# EAGLE board OOBD-TigerV2_old (EAGLE 7.2.0)
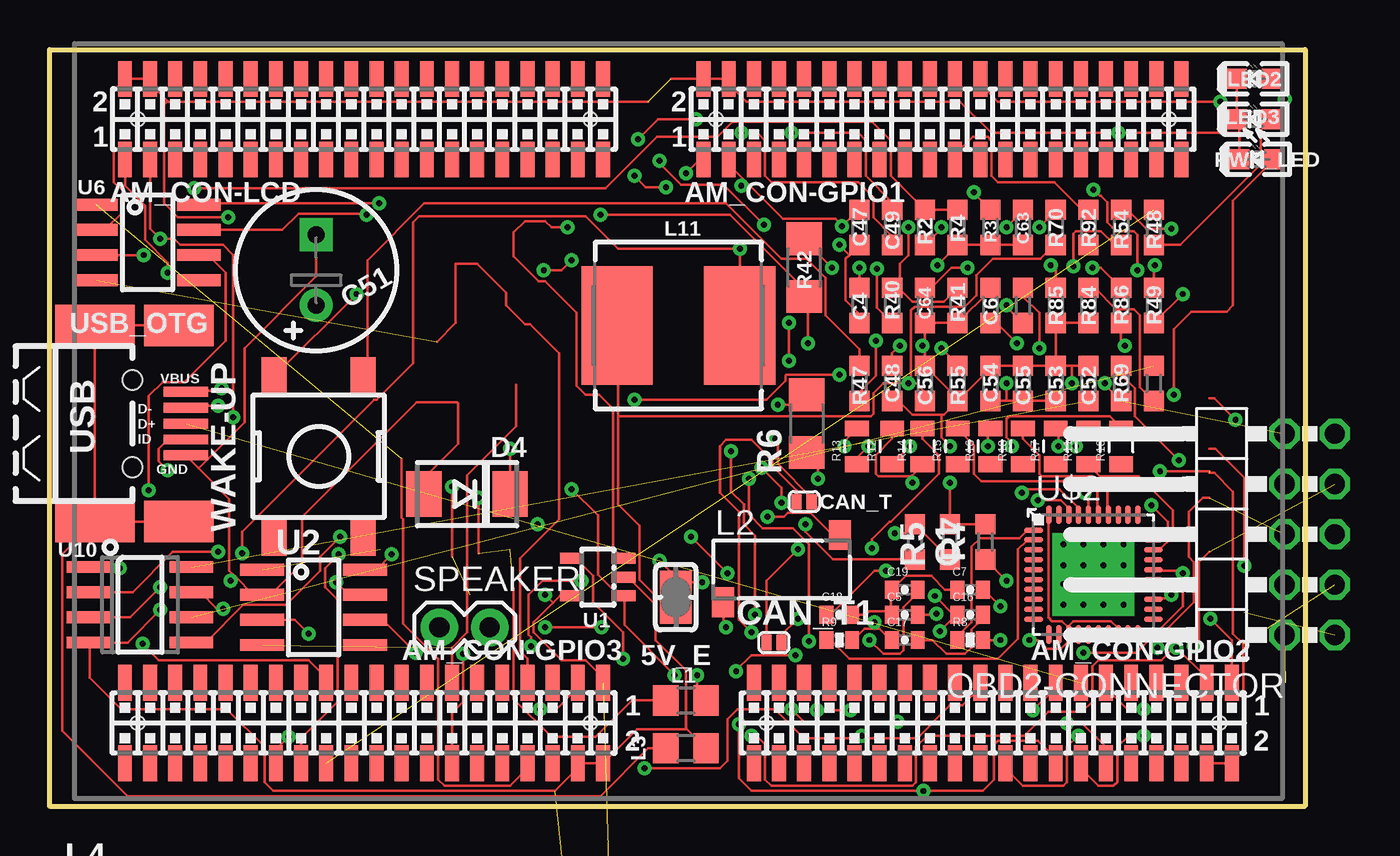
[diagram p5: board, top side]
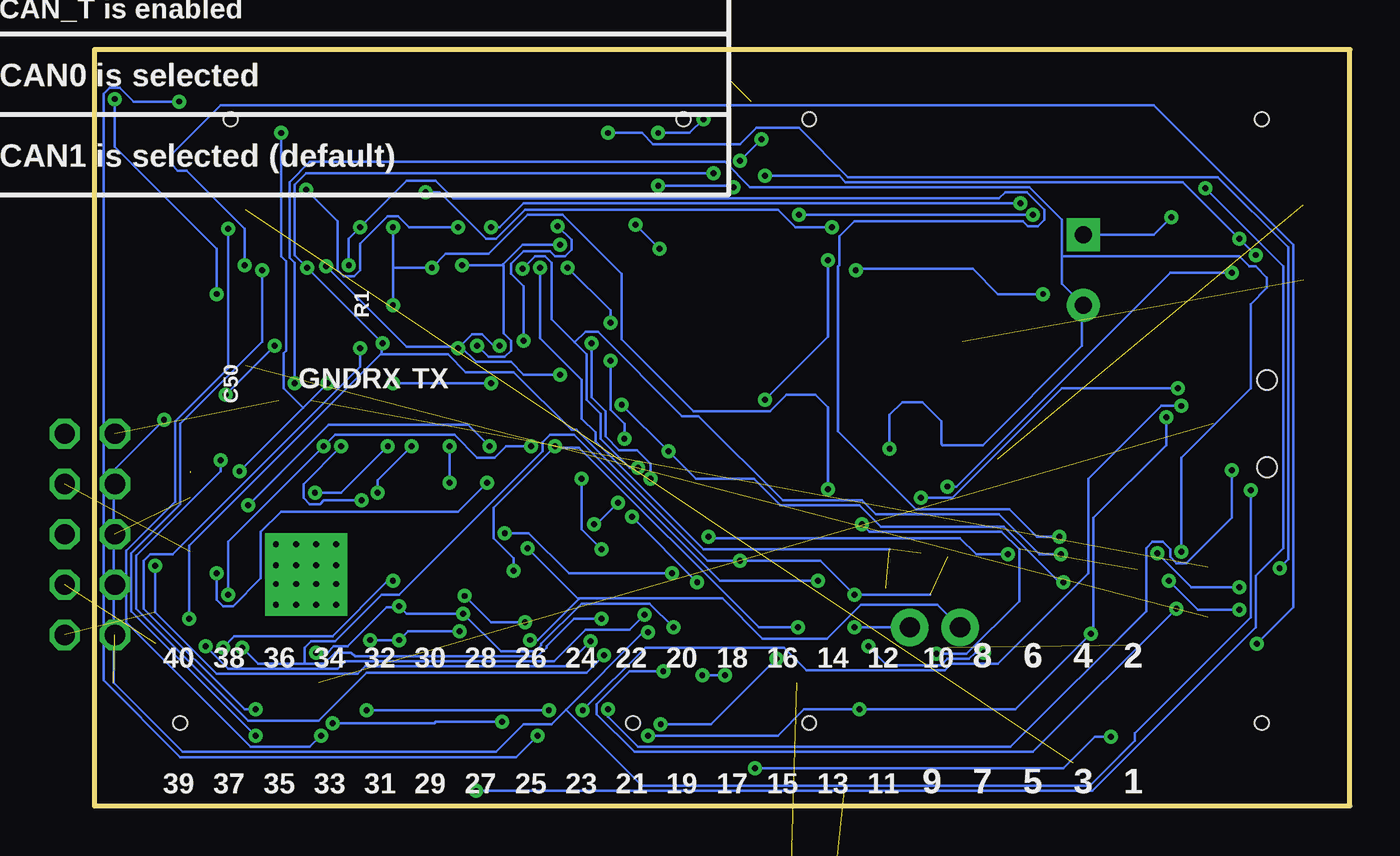
[diagram p6: board, bottom side, seen from below]

Size 63.39 x 38.18 mm. Coordinates in mm from the lower left corner, seen from the top.
Outline: 0,0 63.39,0 63.39,38.18 0,38.18 0,0
Copper layers (1+16): Top 0.035mm / dielectric 1.5mm / Bottom 0.035mm
Design rules "default": minimum track width 5mil, minimum drill 0.3mm, track to track 5mil, track to pad 5mil, pad to pad 5mil, via to via 5mil, smd to smd 1mil, copper to edge 10mil, drill to drill 8mil, minimum pad ring 8mil, minimum via ring 8mil, stop-mask expansion 4mil, vias tented up to drill 25mil, thermal gap 20mil
Net classes: 2 lan_sh: clearance 0.762 mm

## Footprints (pad centres in the part's own frame; a part is rotated, then mirrored left to right if it is on the bottom)
SJ-CLOSE = smd 1.168 x 1.6: 1 -0.762,0; 2 0.762,0
AM3352-SOM-EVB = smd 0.7 x 1.8: 1-1 -27.94,13.208; 1-2 -27.94,17.272; 1-3 -26.67,13.208; 1-4 -26.67,17.272; 1-5 -25.4,13.208; 1-6 -25.4,17.272; 1-7 -24.13,13.208; 1-8 -24.13,17.272; 1-9 -22.86,13.208; 1-10 -22.86,17.272; 1-11 -21.59,13.208; 1-12 -21.59,17.272; 1-13 -20.32,13.208; 1-14 -20.32,17.272; 1-15 -19.05,13.208; 1-16 -19.05,17.272; 1-17 -17.78,13.208; 1-18 -17.78,17.272; 1-19 -16.51,13.208; 1-20 -16.51,17.272; 1-21 -15.24,13.208; 1-22 -15.24,17.272; 1-23 -13.97,13.208; 1-24 -13.97,17.272; 1-25 -12.7,13.208; 1-26 -12.7,17.272; 1-27 -11.43,13.208; 1-28 -11.43,17.272; 1-29 -10.16,13.208; 1-30 -10.16,17.272; 1-31 -8.89,13.208; 1-32 -8.89,17.272; 1-33 -7.62,13.208; 1-34 -7.62,17.272; 1-35 -6.35,13.208; 1-36 -6.35,17.272; 1-37 -5.08,13.208; 1-38 -5.08,17.272; 1-39 -3.81,13.208; 1-40 -3.81,17.272; 2-1 1.27,13.208; 2-2 1.27,17.272; 2-3 2.54,13.208; 2-4 2.54,17.272; 2-5 3.81,13.208; 2-6 3.81,17.272; 2-7 5.08,13.208; 2-8 5.08,17.272; 2-9 6.35,13.208; 2-10 6.35,17.272; 2-11 7.62,13.208; 2-12 7.62,17.272; 2-13 8.89,13.208; 2-14 8.89,17.272; 2-15 10.16,13.208; 2-16 10.16,17.272; 2-17 11.43,13.208; 2-18 11.43,17.272; 2-19 12.7,13.208; 2-20 12.7,17.272; 2-21 13.97,13.208; 2-22 13.97,17.272; 2-23 15.24,13.208; 2-24 15.24,17.272; 2-25 16.51,13.208; 2-26 16.51,17.272; 2-27 17.78,13.208; 2-28 17.78,17.272; 2-29 19.05,13.208; 2-30 19.05,17.272; 2-31 20.32,13.208; 2-32 20.32,17.272; 2-33 21.59,13.208; 2-34 21.59,17.272; 2-35 22.86,13.208; 2-36 22.86,17.272; 2-37 24.13,13.208; 2-38 24.13,17.272; 2-39 25.4,13.208; 2-40 25.4,17.272; 3-1 27.94,-13.208; 3-2 27.94,-17.272; 3-3 26.67,-13.208; 3-4 26.67,-17.272; 3-5 25.4,-13.208; 3-6 25.4,-17.272; 3-7 24.13,-13.208; 3-8 24.13,-17.272; 3-9 22.86,-13.208; 3-10 22.86,-17.272; 3-11 21.59,-13.208; 3-12 21.59,-17.272; 3-13 20.32,-13.208; 3-14 20.32,-17.272; 3-15 19.05,-13.208; 3-16 19.05,-17.272; 3-17 17.78,-13.208; 3-18 17.78,-17.272; 3-19 16.51,-13.208; 3-20 16.51,-17.272; 3-21 15.24,-13.208; 3-22 15.24,-17.272; 3-23 13.97,-13.208; 3-24 13.97,-17.272; 3-25 12.7,-13.208; 3-26 12.7,-17.272; 3-27 11.43,-13.208; 3-28 11.43,-17.272; 3-29 10.16,-13.208; 3-30 10.16,-17.272; 3-31 8.89,-13.208; 3-32 8.89,-17.272; 3-33 7.62,-13.208; 3-34 7.62,-17.272; 3-35 6.35,-13.208; 3-36 6.35,-17.272; 3-37 5.08,-13.208; 3-38 5.08,-17.272; 3-39 3.81,-13.208; 3-40 3.81,-17.272; 4-1 -3.81,-13.208; 4-2 -3.81,-17.272; 4-3 -5.08,-13.208; 4-4 -5.08,-17.272; 4-5 -6.35,-13.208; 4-6 -6.35,-17.272; 4-7 -7.62,-13.208; 4-8 -7.62,-17.272; 4-9 -8.89,-13.208; 4-10 -8.89,-17.272; 4-11 -10.16,-13.208; 4-12 -10.16,-17.272; 4-13 -11.43,-13.208; 4-14 -11.43,-17.272; 4-15 -12.7,-13.208; 4-16 -12.7,-17.272; 4-17 -13.97,-13.208; 4-18 -13.97,-17.272; 4-19 -15.24,-13.208; 4-20 -15.24,-17.272; 4-21 -16.51,-13.208; 4-22 -16.51,-17.272; 4-23 -17.78,-13.208; 4-24 -17.78,-17.272; 4-25 -19.05,-13.208; 4-26 -19.05,-17.272; 4-27 -20.32,-13.208; 4-28 -20.32,-17.272; 4-29 -21.59,-13.208; 4-30 -21.59,-17.272; 4-31 -22.86,-13.208; 4-32 -22.86,-17.272; 4-33 -24.13,-13.208; 4-34 -24.13,-17.272; 4-35 -25.4,-13.208; 4-36 -25.4,-17.272; 4-37 -26.67,-13.208; 4-38 -26.67,-17.272; 4-39 -27.94,-13.208; 4-40 -27.94,-17.272 | hole 0.7: -27.305,15.24; -4.445,15.24; 1.905,15.24; 24.765,15.24; 27.305,-15.24; 4.445,-15.24; -4.445,-15.24; -27.305,-15.24
C0603_DWS = smd 1.016 x 1.016: 1 -0.889,0; 2 0.889,0
0402-CAP = smd 0.7 x 0.9: 1 -0.65,0; 2 0.65,0
E3,5-8 = drill 0.864 pad 1.676: + -1.778,0 | drill 0.864 pad 1.676 square: - 1.778,0
SJ_1_SMALLER = smd 0.508 x 0.762: 1 -0.381,0; 2 0.381,0
DO214AA = smd 1.778 x 2.286: A 2.177,0; C -2.177,0
L0805_5MIL_DWS = smd 1.27 x 1.524: 1 -1.016,0; 2 1.016,0
SM-L15B = smd 1.1 x 1.5: 1 -2.95,-1.65; 2 2.95,1.75
8X8MM_3131 = smd 3.6 x 6: 1 -3.1,0; 2 3.1,0
LED_0603 = smd 1.016 x 1.016: A 0.889,0; C -0.889,0
2X05/90 = drill 1.016 octagon: 1 -5.08,-6.35; 2 -5.08,-3.81; 3 -2.54,-6.35; 4 -2.54,-3.81; 5 0,-6.35; 6 0,-3.81; 7 2.54,-6.35; 8 2.54,-3.81; 9 5.08,-6.35; 10 5.08,-3.81
LED-0603 = smd 1.016 x 1.016: A 0.889,0; C -0.889,0
R0603_5MIL_DWS = smd 1.016 x 1.016: 1 -0.889,0; 2 0.889,0
R1206_5MIL_WS = smd 1.651 x 1.778: 1 -1.46,0; 2 1.46,0
0402-RES = smd 0.7 x 0.9: 1 -0.65,0; 2 0.65,0
0805 = smd 0.8 x 1.2: 1 -0.9,0; 2 0.9,0
1X02 = drill 1.016 pad 1.88: 1 0,0; 2 2.54,0
SOT23-5 = smd 1.2 x 0.55: 1 1.3,-0.95; 2 1.3,0; 3 1.3,0.95; 4 -1.3,0.95; 5 -1.3,-0.95
SO-08 = smd 0.6 x 2.2: 1 -1.905,-2.6; 2 -0.635,-2.6; 3 0.635,-2.6; 4 1.905,-2.6; 5 1.905,2.6; 6 0.635,2.6; 7 -0.635,2.6; 8 -1.905,2.6
SOIC8 = smd 0.6 x 2.2: 1 -1.905,-2.6; 2 -0.635,-2.6; 3 0.635,-2.6; 4 1.905,-2.6; 5 1.905,2.6; 6 0.635,2.6; 7 -0.635,2.6; 8 -1.905,2.6
QFN40-6X6 = smd 0.95 x 0.28: 1 -3.025,2.25; 2 -3.025,1.75; 3 -3.025,1.25; 4 -3.025,0.75; 5 -3.025,0.25; 6 -3.025,-0.25; 7 -3.025,-0.75; 8 -3.025,-1.25; 9 -3.025,-1.75; 10 -3.025,-2.25; 21 3.025,-2.25; 22 3.025,-1.75; 23 3.025,-1.25; 24 3.025,-0.75; 25 3.025,-0.25; 26 3.025,0.25; 27 3.025,0.75; 28 3.025,1.25; 29 3.025,1.75; 30 3.025,2.25 | smd 0.28 x 0.95: 11 -2.25,-3.025; 12 -1.75,-3.025; 13 -1.25,-3.025; 14 -0.75,-3.025; 15 -0.25,-3.025; 16 0.25,-3.025; 17 0.75,-3.025; 18 1.25,-3.025; 19 1.75,-3.025; 20 2.25,-3.025; 31 2.25,3.025; 32 1.75,3.025; 33 1.25,3.025; 34 0.75,3.025; 35 0.25,3.025; 36 -0.25,3.025; 37 -0.75,3.025; 38 -1.25,3.025; 39 -1.75,3.025; 40 -2.25,3.025 | drill 0.3 pad 1.1 square: EP@1 -1.525,1.525; EP@2 -0.5,1.525; EP@3 0.5,1.525; EP@4 1.525,1.525; EP@5 -1.525,0.475; EP@6 -0.5,0.475; EP@7 0.5,0.475; EP@8 1.525,0.475; EP@9 -1.525,-0.475; EP@10 -0.5,-0.475; EP@11 0.5,-0.475; EP@12 1.525,-0.475; EP@13 -1.525,-1.525; EP@14 -0.5,-1.525; EP@15 0.5,-1.525; EP@16 1.525,-1.525
USB_MINI_9PIN = smd 2.25 x 0.5: D+ 2.706,0; D- 2.706,0.8; GND 2.706,-1.6; ID 2.706,-0.8; VBUS 2.706,1.6 | smd 4 x 2.1: GND1 -1.9,4.95; GND3 -1.9,-4.95 | smd 3.5 x 2.1: GND2 2.35,4.95; GND4 2.35,-4.95 | hole 1: 0,2.2; 0,-2.2
T1157 = smd 1.27 x 1.905: 1 -2.25,4.054; 2 2.25,4.054; 3 2.25,-4.054; 4 -2.25,-4.054

## Placement (x,y rotation side)
5V_E  Close  [SJ-CLOSE]  31.62,10.54 90 top
5V_E1  Close  [SJ-CLOSE]  2.54,-55.88 0 top  (outside the outline)
AM3352-SOM-EVB-PLATFORM  4XGPH127SMT-02X20(PA-V16X-2X20-LF)  [AM3352-SOM-EVB]  31.75,19.43 0 top
C1  100nF  [C0603_DWS]  47.24,13.34 90 top
C2  100nF  [C0603_DWS]  10.16,-55.88 0 top  (outside the outline)
C3  10nF  [C0603_DWS]  25.4,-55.88 0 top  (outside the outline)
C4  100nF  [C0603_DWS]  40.89,25.27 270 top
C5  47pF  [0402-CAP]  43.18,9.65 0 top
C6  100nF  [C0603_DWS]  47.5,25.27 90 top
C7  47pF  [0402-CAP]  46.48,10.92 0 top
C8  3.3nF  [C0603_DWS]  17.78,-55.88 0 top  (outside the outline)
C9  22uF/6.3V  [C0603_DWS]  27.94,-30.48 0 top  (outside the outline)
C10  470uF/25V/LOWESR/105C  [E3,5-8]  2.54,-22.86 0 top  (outside the outline)
C11  22uF/6.3V  [C0603_DWS]  0,-40.64 0 top  (outside the outline)
C12  22uF/6.3V  [C0603_DWS]  12.7,-40.64 0 top  (outside the outline)
C13  22uF/6.3V  [C0603_DWS]  25.4,-40.64 0 top  (outside the outline)
C16  22µf  [0402-CAP]  46.48,9.65 0 top
C17  0.1µf  [0402-CAP]  43.18,8.38 0 top
C18  0,01µF  [0402-CAP]  39.88,9.65 0 top
C19  0,01µF  [0402-CAP]  43.18,10.92 0 top
C47  100nF  [C0603_DWS]  40.89,29.21 270 top
C48  100nF  [C0603_DWS]  42.55,21.34 270 top
C49  10nF  [C0603_DWS]  42.55,29.21 270 top
C50  3.3nF  [C0603_DWS]  55.75,21.34 270 top
C51  470uF/25V/LOWESR/105C  [E3,5-8]  13.46,27.05 90 top
C52  100nF  [C0603_DWS]  52.45,21.34 90 top
C53  22uF/6.3V  [C0603_DWS]  50.8,21.34 90 top
C54  22uF/6.3V  [C0603_DWS]  47.5,21.34 90 top
C55  22uF/6.3V  [C0603_DWS]  49.15,21.34 90 top
C56  22uF/6.3V  [C0603_DWS]  44.2,21.34 90 top
C63  22uF/6.3V  [C0603_DWS]  49.15,29.21 270 top
C64  22uF/6.3V  [C0603_DWS]  44.2,25.27 270 top
CAN_T  Open  [SJ_1_SMALLER]  38.1,15.37 180 top
CAN_T1  Open  [SJ_1_SMALLER]  36.58,8.26 0 top
D4  SMBJ16A  [DO214AA]  21.08,15.75 180 top
L1  FB0805/600R/2A  [L0805_5MIL_DWS]  32.13,5.33 0 top
L2  [SM-L15B]  36.96,11.94 0 top
L3  FB0805/600R/200mA(201209-601)  [L0805_5MIL_DWS]  32.13,2.92 180 top
L4  10uH/3.15A/20%  [8X8MM_3131]  5.08,-7.62 0 top  (outside the outline)
L11  10uH/3.15A/20%  [8X8MM_3131]  31.75,24.26 180 top
LED2  LED/Red/0603  [LED_0603]  60.83,36.7 0 top
LED3  LED/Yellow/0603  [LED_0603]  60.83,34.67 0 top
OBD2-CONNECTOR  [2X05/90]  58.55,13.72 90 top
PWR_LED  LED/Red/0603  [LED-0603]  60.96,32.64 0 top
PWR_LED1  LED/Red/0603  [LED-0603]  12.7,-33.02 0 top  (outside the outline)
R1  2.2k/1%  [R0603_5MIL_DWS]  49.15,25.27 270 top
R2  NA  [R0603_5MIL_DWS]  44.2,29.21 270 top
R3  13k/1%  [R0603_5MIL_DWS]  47.5,29.21 90 top
R4  10k  [R0603_5MIL_DWS]  45.85,29.21 90 top
R5  10k  [R0603_5MIL_DWS]  45.47,13.34 90 top
R6  120R  [R1206_5MIL_WS]  38.23,19.3 90 top
R7  NA  [R0603_5MIL_DWS]  43.69,13.34 270 top
R8  10K  [0402-RES]  46.48,8.38 0 top
R9  10K  [0402-RES]  39.88,8.38 0 top
R10  0  [0805]  54.1,18.16 90 top
R11  0  [0805]  52.45,18.16 90 top
R12  0  [0805]  42.55,18.16 90 top
R13  0  [0805]  40.77,18.16 90 top
R14  0  [0805]  44.07,18.16 90 top
R15  0  [0805]  45.85,18.16 90 top
R16  0  [0805]  47.5,18.16 90 top
R17  0  [0805]  50.8,18.16 90 top
R18  0  [0805]  49.15,18.16 90 top
R19  10k  [R0603_5MIL_DWS]  33.02,-55.88 0 top  (outside the outline)
R20  2.2k/1%  [R0603_5MIL_DWS]  20.32,-48.26 0 top  (outside the outline)
R21  1.05k/1%  [R0603_5MIL_DWS]  0,-48.26 0 top  (outside the outline)
R22  4.99k/1%  [R0603_5MIL_DWS]  10.16,-48.26 0 top  (outside the outline)
R23  2.2k/1%  [R0603_5MIL_DWS]  30.48,-48.26 0 top  (outside the outline)
R40  NA  [R0603_5MIL_DWS]  42.55,25.27 270 top
R41  10k  [R0603_5MIL_DWS]  45.85,25.27 270 top
R42  120R  [R1206_5MIL_WS]  38.1,27.18 270 top
R47  2.2k/1%  [R0603_5MIL_DWS]  40.89,21.34 270 top
R48  2.2k/1%  [R0603_5MIL_DWS]  55.75,29.21 270 top
R49  2.2k/1%  [R0603_5MIL_DWS]  55.75,25.27 270 top
R54  49.9R/1%  [R0603_5MIL_DWS]  54.1,29.21 270 top
R55  NA  [R0603_5MIL_DWS]  45.85,21.34 270 top
R69  10k  [R0603_5MIL_DWS]  54.1,21.34 90 top
R70  4.99k/1%  [R0603_5MIL_DWS]  50.8,29.21 270 top
R84  2.2k/1%  [R0603_5MIL_DWS]  52.45,25.27 270 top
R85  1.05k/1%  [R0603_5MIL_DWS]  50.8,25.27 270 top
R86  2.2k/1%  [R0603_5MIL_DWS]  54.1,25.27 270 top
R92  0R  [R0603_5MIL_DWS]  52.45,29.21 90 top
SPEAKER  LS1  [1X02]  19.68,9.02 0 top
U1  SY6280  [SOT23-5]  27.69,11.56 0 top
U2  SN65HVD230(SO8)  [SO-08]  13.34,10.03 270 top
U3  MP1482DS  [SOIC8]  30.48,-22.86 0 top  (outside the outline)
U6  SN65HVD230(SO8)  [SO-08]  4.95,28.45 270 top
U10  MP1482DS  [SOIC8]  4.57,10.16 270 top
U$2  [QFN40-6X6]  52.7,11.68 0 top
USB_OTG  USB-OTG  [USB_MINI_9PIN]  4.19,19.3 0 top
WAKE-UP  T1157  [T1157]  13.59,17.65 0 top

## Tracks (layer width: path | path; a pad name or v marks a point on that pad's centre or on a via)
3.3V  (via drill 0.3)
  Top 0.127: 41.66,8.95 41.91,8.95 42.48,8.38 C17.1 | 41.66,8.95 41.15,8.95 40.58,8.38 R9.2 | v48.01,8.38 R8.2 | v49.47,8.38 49.91,8.38 50.35,7.94 51.05,7.94 51.44,8.32 51.44,8.64 U$2.13 | v44.96,8.83 45.72,9.59 | 45.72,9.59 45.78,9.65 C16.1 45.72,9.59 | U$2.40 50.42,14.67 50.42,9.53 50.61,9.34 51.12,9.34 51.44,9.02 51.44,8.7 U$2.13 | U$2.18 53.91,8.7 53.91,9.02 53.59,9.34 51.69,9.34 51.44,9.08 U$2.13 | v41.66,9.27 41.66,8.95 | 45.72,9.59 v44.7,10.6
  Bottom 0.127: v49.47,8.38 v48.01,8.38 47.56,8.83 v44.96,8.83 | v41.66,9.27 43.37,9.27 v44.7,10.6
+5V  (via drill 0.3)  (3 unrouted)
  Top 0.127: C6.1 47.82,24.38 v48.83,23.37 | v52.64,27.18 53.09,27.18 R86.1 | AM3352-SOM-EVB-PLATFORM.3-1 59.69,8.38 v58.61,9.46 | AM3352-SOM-EVB-PLATFORM.2-1 32.83,32.64 v32.13,31.94 | v36.26,14.61 37.08,14.61 37.27,14.8 38.42,14.8 39.5,13.72 39.88,13.72 L2.2 | v32.96,11.3 5V_E.2 31.62,11.56 v30.8,12.38 | 25.43,10.26 24.45,9.27 24.45,8.76 25.84,7.37 27.05,7.37 27.94,6.48 AM3352-SOM-EVB-PLATFORM.4-1 | 25.43,10.26 25.78,10.6 26.35,10.6 U1.5 | AM3352-SOM-EVB-PLATFORM.1-1 3.81,31.3 4.83,30.29 4.83,28.57 5.97,27.43 v5.97,26.92 | 20.32,12.57 v20.32,16.13 | v25.02,10.67 25.43,10.26
  Bottom 0.127: v58.61,9.46 58.61,13.14 48.93,22.83 | 48.93,22.83 48.9,22.86 48.9,23.37 v48.83,23.37 v52.64,27.18 53.28,27.81 53.28,31.37 52.7,31.94 v32.13,31.94 | v32.96,11.3 v36.26,14.61 | v5.97,26.92 9.08,26.92 19.88,16.13 v20.32,16.13 | 21.21,10.67 v25.02,10.67 26.73,12.38 v30.8,12.38 32.45,12.38 39.05,18.99 39.31,18.99 42.23,21.91 44.64,21.91 45.53,22.8 48.9,22.8 48.93,22.83
+5V_OTG_PWR  (via drill 0.3)  (2 unrouted)
  Top 0.127: v40.89,27.18 C4.1 | L1.1 29.4,5.33 27.56,3.49 25.34,3.49 23.43,5.4 23.43,10.99 | v8.7,21.08 8.57,20.95 6.92,20.95 USB_OTG.VBUS | 21.65,12.76 v21.65,15.56
  Bottom 0.127: v40.89,27.18 40.89,23.62 38.8,21.53 38.8,19.56 38.1,18.86 38.1,18.41 32.64,12.95 23.24,12.95 | v8.7,21.08 14.54,21.08 20.07,15.56 v21.65,15.56
+12V  (via drill 0.3)  (1 unrouted)
  Top 0.127: R69.1 53.28,21.27 v53.28,21.34 | U10.2 4.19,10.79 6.22,12.83 v8.51,12.83 | v23.24,18.03 23.24,15.75 D4.C
  Bottom 0.127: v53.28,21.34 53.28,27.43 53.53,27.69 53.53,31.5 52.51,32.51 31.56,32.51 30.29,31.24 16.19,31.24 14.54,29.59 14.54,27.75 | 14.54,27.75 14.54,26.35 C51.+ 13.53,25.27 13.53,23.24 18.54,18.22 20.57,18.22 20.64,18.29 20.64,19.43 21.59,20.38 22.61,20.38 23.24,19.75 v23.24,18.03 | v8.51,12.83 8.51,17.59 5.02,21.08 5.02,25.34 4.19,26.16 4.19,26.67 4.76,27.24 5.08,27.24 5.59,27.75 14.54,27.75
AGND
  Top 0.127: C18.2 41.21,9.65 41.4,9.84 42.29,9.84 42.48,9.65 C5.1 42.35,9.84 42.48,9.97 42.48,10.92 C19.1 42.55,10.92 43.24,11.62 44.51,11.62 45.21,10.92 C7.1
CANH  (via drill 0.3)  (1 unrouted)
  Top 0.127: 58.55,18.03 58.86,18.03 60.33,16.57 v60.33,12.13 | v38.35,8.32 38.35,13.21 37.53,14.03 36.01,14.03 35.31,14.73 v35.31,16.51 | v38.29,23.37 38.29,25.53 R42.2 38.1,26.1 34.35,29.84 v27.81,29.84 | U6.7 11.75,29.08 12.57,29.91 15.94,29.91 v16,29.84
  Bottom 0.127: v60.33,12.13 60.33,9.78 57.21,6.67 50.1,6.67 49.72,7.05 39.62,7.05 v38.35,8.32 | v35.31,16.51 35.31,17.27 36.01,17.97 36.89,17.97 37.59,18.67 37.59,19.94 38.29,20.64 v38.29,23.37 | v27.81,29.84 v16,29.84
CANH1  (via drill 0.3)  (1 unrouted)
  Top 0.127: 58.55,12.83 58.04,12.32 58.04,8.32 v57.78,8.06 | v35.62,9.65 35.62,13.65 35.05,14.22 35.05,15.24 34.42,15.88 v34.42,17.91 | v36.77,20.26 37.72,20.26 R6.2 | U2.7 15.11,10.67 v14.48,11.3
  Bottom 0.127: v57.78,8.06 56.64,6.92 51.12,6.92 50.74,7.3 40.2,7.3 38.61,8.89 36.39,8.89 v35.62,9.65 | v36.77,20.26 v34.42,17.91 33.02,16.51 30.1,16.51 28.77,15.18 24.77,15.18 23.69,14.1 17.46,14.1 14.67,11.3 v14.48,11.3
CANL  (via drill 0.3)  (1 unrouted)
  Top 0.127: CAN_T.2 37.72,15.94 36.51,17.14 36.51,17.4 35.43,18.48 34.16,18.48 33.85,18.16 33.85,15.81 34.8,14.86 34.8,9.4 v35.43,8.76 | v59.88,19.49 58.8,20.57 58.55,20.57 | U6.6 8,27.81 8.89,26.92 8.89,23.5 6.79,21.4 5.71,21.4 5.02,20.7 v5.02,15.94
  Bottom 0.127: v35.43,8.76 35.69,8.76 39.59,4.86 | 39.59,4.86 40.32,4.13 41.72,4.13 43.12,2.73 58.93,2.73 62.42,6.22 62.42,16.95 v59.88,19.49 | v5.02,15.94 5.02,9.53 10.86,3.68 10.86,3.3 13.14,1.02 35.75,1.02 39.59,4.86
CANL1  (via drill 0.3)  (1 unrouted)
  Top 0.127: CAN_T1.2 36.96,8.64 v37.78,9.46 | v55.94,8 55.94,8.45 57.78,10.29 57.78,12.32 57.53,12.57 57.53,14.86 58.23,15.56 58.55,15.56 | U2.6 16.83,9.4 v18.48,7.75 | v24.32,8.06 24.32,8.51 24.19,8.64 24.19,10.67 24.89,11.37 v26.86,11.37
  Bottom 0.127: v37.78,9.46 39.18,9.46 40.58,8.06 40.58,8 41.02,7.56 50.23,7.56 50.42,7.75 51.24,7.75 51.82,7.18 52.77,7.18 | 52.77,7.18 55.12,7.18 v55.94,8 | v18.48,7.75 18.92,7.75 19.24,7.43 20.32,7.43 20.64,7.11 23.37,7.11 v24.32,8.06 | v26.86,11.37 31.81,11.37 39.18,18.73 40.39,18.73 40.77,18.35 40.77,17.91 48.01,10.67 48.9,10.67 51.24,8.32 52.45,8.32 52.77,8 52.77,7.18
EXT_WAKEUP  (via drill 0.3)
  Top 0.127: R54.1 54.42,30.1 55.37,29.15 v56.64,29.15 | v51.94,3.56 51.37,2.98 51.37,1.21 51.18,1.02 49.15,1.02 48.26,1.91 AM3352-SOM-EVB-PLATFORM.3-20
  Bottom 0.127: v56.64,29.15 56.64,22.1 59.31,19.43 59.31,15.37 61.78,12.89 61.78,9.27 55.5,2.98 52.51,2.98 v51.94,3.56
GND  (via drill 0.3)  (10 unrouted)
  Top 0.127: 58.55,16.83 58.8,16.83 59.75,15.88 59.75,8.7 60.26,8.19 60.26,2.73 AM3352-SOM-EVB-PLATFORM.3-2 AM3352-SOM-EVB-PLATFORM.3-4 | C63.2 R3.1 R4.1 v44.83,27.3 | C4.2 40.89,24.83 40.2,25.53 40.2,27.62 40.39,27.81 | C47.2 40.39,27.81 | 40.39,27.81 v39.88,28.32 | 44.2,23.24 C64.2 R41.2 47.5,26.04 C6.2 | 44.2,23.24 C56.2 45.91,20.51 | R84.2 R85.2 C53.2 | C53.2 C55.2 C54.2 47.5,22.1 45.91,20.51 | C53.2 51.63,22.23 | 51.63,22.23 C52.2 | C1.2 R5.2 v45.47,16.32 | C48.2 42.86,20.45 43.56,19.75 45.02,19.75 | 45.02,19.75 45.15,19.75 R55.2 45.91,20.51 | v45.47,18.16 45.02,18.61 45.02,19.75 | 44.2,23.24 v44.07,23.24 | v56.07,16.89 58.55,16.89 | 51.63,22.23 v51.63,21.34 | U1.2 29.21,11.56 30.61,10.16 30.61,8.38 32.13,6.86 32.13,3.94 32.16,3.9 | L3.1 32.16,3.9 | 2.03,8.26 2.03,6.48 3.62,4.89 8.95,4.89 10.86,2.98 10.86,1.21 11.3,0.76 25.53,0.76 26.67,1.91 AM3352-SOM-EVB-PLATFORM.4-4 AM3352-SOM-EVB-PLATFORM.4-2 29.65,3.87 32.13,3.87 32.16,3.9 | 9.37,11.59 9.08,11.87 9.08,15.49 7.53,17.05 | 9.37,11.59 10.29,10.67 U2.2 11.18,10.67 12.76,12.26 12.76,14.61 18.54,20.38 20.57,20.38 20.64,20.32 20.64,18.29 18.92,16.57 18.92,15.75 D4.A | 7.53,17.05 6.92,17.65 USB_OTG.GND | C51.- 13.46,26.73 9.84,23.11 9.84,19.37 7.53,17.05 | U6.2 2.79,29.08 3.68,29.97 3.68,31.05 3.24,31.5 3.24,36.13 AM3352-SOM-EVB-PLATFORM.1-2 AM3352-SOM-EVB-PLATFORM.1-4 5.08,36.45 5.94,35.59 | LED2.C LED3.C 60.07,34.54 60.07,33.97 | 60.07,33.97 PWR_LED.C | 31.37,36.7 AM3352-SOM-EVB-PLATFORM.2-2 AM3352-SOM-EVB-PLATFORM.2-4 34.29,36.45 35.18,35.56 45.97,35.56 47.56,33.97 v53.98,33.97 60.07,33.97 | 5.94,35.59 5.97,35.56 30.23,35.56
  Top 0.127: v9.02,29.72 6.48,29.72 5.78,30.42 5.78,35.43 5.94,35.59 | 2.03,8.26 3.94,8.26 v5.59,9.91 | 9.37,11.59 v9.14,11.37 | 2.03,8.26 U10.4
  Bottom 0.127: v44.83,27.3 42.8,27.3 42.77,27.34 | 42.77,27.34 41.78,28.32 v39.88,28.32 | v45.47,18.16 v45.47,16.32 | v44.07,23.24 43.5,22.67 42.67,22.67 42.35,22.99 42.35,23.5 42.74,23.88 42.74,27.3 42.77,27.34 | v51.63,21.34 52.86,20.1 | 52.86,20.1 v56.07,16.89 | C51.- 9.91,28.83 v9.02,29.72 | v5.59,9.91 7.68,9.91 v9.14,11.37 | 52.86,20.1 53.85,21.08 53.85,22.86 53.72,22.99 53.72,27.5 53.98,27.75 v53.98,33.97
N$1  (via drill 0.3)
  Top 0.127: v57.21,25.84 R49.2 | v62.36,35.69 62.36,36.07 LED2.A
  Bottom 0.127: v57.21,25.84 57.21,28.13 62.36,33.27 v62.36,35.69
N$2  (via drill 0.3)
  Top 0.127: CAN_T1.1 36.2,11.37 v37.78,12.95 | v38.8,16.51 38.8,17.27 R6.1
  Bottom 0.127: v37.78,12.95 38.8,13.97 v38.8,16.51
N$4  (1 unrouted)
N$5  (via drill 0.3)
  Top 0.127: R5.1 R7.1 43.69,14.16 43.31,13.78 v42.67,13.78 | U2.8 16.51,11.94 v17.27,12.7 | v34.23,11.75 v32.38,13.59
  Bottom 0.127: v17.27,12.7 18.86,12.7 19.68,13.53 32.32,13.53 v32.38,13.59 | v34.23,11.75 39.43,11.75 41.47,13.78 v42.67,13.78
N$6  (via drill 0.3)
  Top 0.127: R69.2 54.1,21.78 54.8,21.08 54.8,19.68 v57.02,17.46 | v37.66,7.62 35.43,7.62 34.67,6.86 v34.67,6.79 | v8.76,9.97 8.45,9.97 7.62,10.79 U10.7
  Bottom 0.127: v57.02,17.46 57.02,16.89 61.28,12.64 61.28,9.97 55.63,4.32 52.07,4.32 49.66,6.73 38.54,6.73 v37.66,7.62 | v34.67,6.79 36.39,6.79 38.04,5.14 38.04,4.64 36.13,2.73 16,2.73 v8.76,9.97
N$7  (via drill 0.3)
  Top 0.127: C49.1 42.55,30.48 41.21,31.81 41.21,33.59 40.83,33.97 v37.47,33.97 | v3.56,12 2.1,12 2.03,12.06 U10.1
  Bottom 0.127: v37.47,33.97 35.75,33.97 35.18,33.4 30.8,33.4 29.97,34.23 27.81,34.23 25.34,31.75 6.67,31.75 3.11,28.19 3.11,12.45 v3.56,12
N$8  (via drill 0.3)
  Top 0.127: C49.2 42.55,28.77 41.59,29.72 41.59,30.73 40.83,31.5 36.45,31.5 36.13,31.81 36.13,33.59 35.75,33.97 v34.92,33.97 | v32.64,34.67 30.73,34.67 v29.72,33.66 | v30.8,32.58 30.8,32.45 31.88,31.37 34.04,31.37 v36.07,29.34 | L11.1 v34.86,28.13 28.7,28.13 27.05,29.78 18.67,29.78 18.35,29.46 18.35,22.35 16.51,20.51 16.38,20.51 9.72,13.84 v9.72,12.76 | U10.3 4.06,9.53 v5.59,11.05
  Bottom 0.127: v34.92,33.97 33.34,33.97 v32.64,34.67 | v30.8,32.58 v29.72,33.66 | v34.86,28.13 v36.07,29.34 | v5.59,11.05 8,11.05 v9.72,12.76
N$9  (1 unrouted)
N$10
  Top 0.127: R9.1 39.43,8.38 40.39,7.43 47.88,7.43 48.9,8.45 48.9,12.95 49.34,13.4 49.66,13.4 U$2.2
N$11
  Top 0.127: R84.1 52.77,26.16 53.85,25.08 54.74,25.08 55.05,24.77 55.05,21.14 C50.2
N$12  (via drill 0.3)
  Top 0.127: 48.32,20.45 C55.1 C53.1 | 48.32,20.45 C54.1 | C56.1 44.2,20.89 43.56,21.53 | 43.56,21.53 43.5,21.59 43.5,25.02 43.69,25.21 46.23,25.21 46.8,25.78 46.8,26.8 47.62,27.62 50.04,27.62 50.74,28.32 R70.2 | v48.32,21.34 48.32,20.45 | 43.56,21.53 v43.37,21.34 42.1,21.34 41.59,20.83 41.59,19.81 41.47,19.68 28.7,19.68 | 5V_E.1 31.43,9.78 29.78,11.43 29.78,14.16 28.7,15.24 28.7,19.68 | 28.7,19.68 28.7,24.26 L11.2
  Bottom 0.127: v43.37,21.34 v48.32,21.34
N$13
  Top 0.127: R92.2 52.13,30.1 50.74,31.5 47.88,31.5 47.56,31.81 47.56,33.59 47.37,33.78 46.61,33.78 45.72,32.89 AM3352-SOM-EVB-PLATFORM.2-21
N$14  (via drill 0.3)
  Top 0.127: v41.4,8.38 42.1,7.68 42.93,7.68 43.12,7.87 43.12,10.03 43.81,10.73 43.81,10.92 C19.2 | R14.2 44.07,18.54 44.9,17.72 44.9,16.76 42.48,14.35 42.42,14.35 41.53,13.46 v41.53,13.02
  Bottom 0.127: v41.4,8.38 41.02,8.38 38.96,10.45 | 38.96,10.45 38.92,10.48 31.69,10.48 29.65,8.45 26.42,8.45 24.7,10.16 20.83,10.16 SPEAKER.1 | 38.96,10.45 v41.53,13.02
N$15  (via drill 0.3)
  Top 0.127: C18.1 39.43,9.65 41.66,11.87 v42.23,11.87 | v40.13,18.16 40.13,18.41 R13.2 | v27.88,9.02 v25.02,9.02
  Bottom 0.127: v42.23,11.87 42.23,12.51 43.24,13.53 43.24,15.05 v40.13,18.16 40.13,18.1 38.92,18.1 29.84,9.02 v27.88,9.02 | v25.02,9.02 SPEAKER.2
N$16
  Top 0.127: C17.2 44.58,8.38 45.28,7.68 46.23,7.68 46.55,8 46.55,8.89 47.12,9.46 47.12,9.65 C16.2
N$17  (via drill 0.3)
  Top 0.127: C5.2 44.7,9.65 v44.77,9.72 | v48.01,10.1 47.18,10.92 C7.2 | v52.2,7.75 54.86,7.75 57.21,10.1 57.21,10.92 56.71,11.43 55.75,11.43 U$2.25 | v34.16,9.02 34.04,9.14 34.04,10.29 L2.1
  Bottom 0.127: v52.2,7.75 51.63,7.75 51.31,8.06 50.61,8.06 48.64,10.03 48.01,10.03 v48.01,10.1 47.62,9.72 v44.77,9.72 42.86,7.81 41.15,7.81 40.83,8.13 40.83,8.19 38.8,10.22 35.37,10.22 v34.16,9.02
N$18  (via drill 0.3)
  Top 0.127: v56.64,10.67 56.45,10.48 55.75,10.48 U$2.23 | v51.82,18.16 51.82,18.41 R11.2 | R13.1 40.77,17.59 v41.34,18.16
  Bottom 0.127: v56.64,10.67 56.64,13.34 v51.82,18.16 51.24,18.73 45.21,18.73 44.07,17.59 43.18,17.59 42.61,18.16 v41.34,18.16
N$19
  Top 0.127: U$2.28 55.75,12.95 56.07,12.95 56.71,13.59 56.71,14.92 54.99,16.64 53.02,16.64 52.45,17.21 R11.1
N$20  (via drill 0.3)
  Top 0.127: v55.63,15.18 56.45,14.35 56.45,13.84 56.07,13.46 55.75,13.46 U$2.29 | v43.43,18.16 42.55,17.27 R12.1
  Bottom 0.127: v55.63,15.18 51.56,19.24 44.51,19.24 v43.43,18.16
N$21  (via drill 0.3)
  Top 0.127: v57.21,11.75 57.09,11.87 55.75,11.87 U$2.26 | 43.56,16.64 43.56,16.7 44.07,17.21 R14.1 | R12.2 42.55,18.54 41.72,17.72 41.72,16.76 41.85,16.64 43.56,16.64 | 43.56,16.64 v43.56,16.32
  Bottom 0.127: v57.21,11.75 57.21,10.41 56.9,10.1 56.39,10.1 54.99,11.49 54.99,13.84 53.98,14.86 45.02,14.86 v43.56,16.32
N$22  (via drill 0.3)
  Top 0.127: v49.91,15.43 51.05,15.43 51.44,15.05 51.44,14.73 U$2.38 | v50.93,18.16 50.93,18.92 R17.2
  Bottom 0.127: v49.91,15.43 51.82,15.43 52.01,15.24 52.51,15.24 52.83,15.56 52.83,16.26 v50.93,18.16
N$23  (via drill 0.3)
  Top 0.127: v49.09,15.81 49.28,16 50.99,16 51.94,15.05 51.94,14.73 U$2.37 | v47.37,18.16 47.37,18.92 R16.2
  Bottom 0.127: v49.09,15.81 49.09,16.45 v47.37,18.16
N$24
  Top 0.127: U$2.35 52.9,14.73 52.9,16 52.51,16.38 47.05,16.38 46.67,16.76 46.67,18.22 R15.2
N$25  (via drill 0.3)
  Top 0.127: v52.26,15.81 52.45,15.62 52.45,14.73 U$2.36 | v48.58,18.16 48.58,18.35 48.32,18.61 48.32,19.56 48.45,19.68 53.53,19.68 54.1,19.11 R10.2
  Bottom 0.127: v52.26,15.81 50.93,15.81 v48.58,18.16
N$26
  Top 0.127: R18.2 49.15,18.54 49.97,17.72 49.97,16.76 50.1,16.64 52.64,16.64 53.4,15.88 53.4,14.73 U$2.34
N$27  (1 unrouted)
N$28  (1 unrouted)
N$29  (2 unrouted)
N$30  (1 unrouted)
N$31  (1 unrouted)
N$32  (2 unrouted)
N$33  (1 unrouted)
N$34  (6 unrouted)
N$43
  Top 0.127: R47.1 40.89,23.05 39.18,24.77 39.18,26.67 38.23,27.62 36.96,27.62 34.16,30.42 18.92,30.42 16.07,27.56 16.07,21.91 15.88,21.72 WAKE-UP.2
N$44  (via drill 0.3)
  Top 0.127: C48.1 42.55,22.86 v42.93,23.24 | v45.02,23.11 45.85,22.29 R55.1 | R54.2 53.78,28.32 53.09,29.02 51.82,29.02 51.69,28.89 v51.69,27.24 | v15.49,25.84 11.37,21.72 WAKE-UP.1 | v24.96,27.05 25.84,27.05 v26.35,27.56 | v29.53,20.51 36.2,20.51 37.15,21.46 37.15,21.72 37.21,21.78 v39.88,21.78
  Bottom 0.127: v42.93,23.24 43.24,23.24 43.81,23.81 44.32,23.81 v45.02,23.11 | v51.69,27.24 47.62,23.18 45.02,23.18 v45.02,23.11 | v15.49,25.84 17.78,25.84 19.05,27.11 24.89,27.11 v24.96,27.05 | v26.35,27.56 26.35,23.69 v29.53,20.51 | v39.88,21.78 41.72,21.78 42.35,22.42 44.13,22.42 44.9,23.18 v45.02,23.11
N$62  (via drill 0.3)
  Top 0.127: R85.1 50.8,27.05 v50.55,27.3 | v49.97,29.21 50.8,30.04 R70.1 | U10.5 7.87,8.26 9.78,10.16 11.94,10.16 13.65,11.87 13.65,12.57 v14.67,13.59
  Bottom 0.127: v50.55,27.3 50.55,28.64 v49.97,29.21 47.62,31.56 46.16,31.56 45.28,30.67 17.72,30.67 17.4,30.99 16.32,30.99 15.43,30.1 15.43,29.59 15.75,29.27 16.26,29.27 16.51,29.53 25.02,29.53 25.78,28.77 25.78,27.3 25.84,27.24 25.84,18.92 21.91,14.99 17.21,14.99 15.81,13.59 v14.67,13.59
N$80  (via drill 0.3)
  Top 0.127: R41.1 45.15,25.46 43.56,25.46 42.86,26.16 R40.1 42.93,26.16 42.93,27.37 43.37,27.81 v43.37,29.21 | v16.64,30.42 7.62,30.42 U6.8
  Bottom 0.127: v43.37,29.21 42.93,29.21 41.72,30.42 v16.64,30.42
N$99  (via drill 0.3)
  Top 0.127: R3.2 46.67,30.92 v46.67,30.99 | v26.16,29.21 25.34,29.21 25.02,29.53 24,29.53 23.43,28.96 23.43,27.75 24.7,26.48 25.02,26.48 26.61,24.89 26.61,21.21 27.05,20.77 27.75,20.77 28.45,20.07 28.45,13.02 28.96,12.51 U1.3
  Bottom 0.127: v46.67,30.99 45.97,30.99 43.62,28.64 43.12,28.64 41.66,30.1 28.89,30.1 28,29.21 v26.16,29.21
N$100  (via drill 0.3)
  Top 0.127: v31.56,6.6 29.02,9.14 29.02,10.6 U1.1 28.96,10.67 28.7,10.67 27.69,11.68 27.69,14.67 v26.35,16 | v32.7,6.6 32.7,5.78 L1.2 | R1.2 48.32,25.21 v48.32,25.27 | v48.32,29.21 49.15,30.04 C63.1 | C64.1 44.51,26.16 45.53,27.18 v46.35,27.18
  Bottom 0.127: v32.7,6.6 v31.56,6.6 | v48.32,29.21 48.32,27.18 | 48.32,27.18 v48.32,25.27 | 48.32,27.18 v46.35,27.18 45.66,27.88 43.5,27.88 41.53,29.84 39.75,29.84 36.77,26.86 36.77,23.56 33.15,19.94 29.27,19.94 28.45,20.77 26.99,20.77 26.35,20.13 v26.35,16
N$129  (via drill 0.3)
  Top 0.127: R86.2 54.1,23.43 v54.29,23.24 | v56.77,20.77 56.77,24.07 57.66,24.96 59.44,24.96 59.75,25.27 59.75,30.54 PWR_LED.A
  Bottom 0.127: v56.77,20.77 v54.29,23.24
N$231
  Top 0.127: R48.2 57.09,28.32 61.15,32.38 61.15,34.1 LED3.A
N$266
  Top 0.127: USB_OTG.GND2 2.35,24.26 USB_OTG.GND1 2.29,24.19 2.29,14.41 USB_OTG.GND3 | L3.2 30.23,2.92 27.81,0.51 3.94,0.51 0.64,3.81 0.64,12.7 USB_OTG.GND3 | USB_OTG.GND4 2.35,14.35 USB_OTG.GND3
N$566  (via drill 0.3)
  Top 0.127: CAN_T.1 38.48,15.56 36.77,17.27 36.77,18.41 v36.64,18.54 | v37.34,24.38 v37.34,22.48 | v39.5,27.18 38.1,28.57 R42.1
  Bottom 0.127: v36.64,18.54 36.64,19.3 37.34,20 v37.34,22.48 | v37.34,24.38 37.34,25.02 v39.5,27.18
P0_12/I2C2_SDA  (1 unrouted)
  Top 0.127: AM3352-SOM-EVB-PLATFORM.4-8 24.13,1.91 23.24,1.02 19.94,1.02 19.62,1.33 19.62,7.43 17.84,9.21 17.84,14.48 17.78,14.54 17.78,17.53
P0_13/I2C2_SCL  (1 unrouted)
  Top 0.127: AM3352-SOM-EVB-PLATFORM.4-7 24.13,7.43 23.75,7.81 23.75,12.51 25.72,14.48 25.72,22.86 24.26,24.32 24,24.32 23.05,25.27 23.05,25.91 21.59,27.37 20.51,27.37 20.51,24.38 19.56,23.43
P1_8/UART4_RXD  (via drill 0.3)  (1 unrouted)
  Top 0.127: AM3352-SOM-EVB-PLATFORM.4-14 20.32,4.7 20.89,5.27 v20.89,7.68
  Bottom 0.127: v20.89,7.68 19.37,7.68 16.7,10.35 16.7,12.95 17.59,13.84 24.26,13.84 v24.64,14.22
P1_9/UART4_TXD  (1 unrouted)
  Top 0.127: AM3352-SOM-EVB-PLATFORM.4-13 20.32,8 21.08,8.76 21.08,16.7 23.56,19.18 23.56,21.27
P3_8/EMU1  (via drill 0.3)
  Top 0.127: R7.2 39.56,12.45 38.16,13.84 v38.16,14.22 | v36.96,15.3 36.96,16.07 v35.94,17.08 | v41.78,27.11 41.78,25.15 R40.2 | AM3352-SOM-EVB-PLATFORM.4-26 12.7,3.43 14.54,5.27 14.54,10.41 13.91,11.05 13.91,12 v14.61,12.7
  Bottom 0.127: v38.16,14.22 38.04,14.22 v36.96,15.3 | v35.94,17.08 36.39,17.08 37.85,18.54 37.85,19.81 38.54,20.51 38.54,22.8 39.15,23.4 | 39.15,23.4 40.32,24.57 40.32,27.43 40.64,27.75 41.15,27.75 v41.78,27.11 | v14.61,12.7 15.68,12.7 17.72,14.73 23.94,14.73 24.64,15.43 28.64,15.43 32.89,19.68 33.72,19.68 37.97,23.94 38.61,23.94 39.15,23.4
P3_20/LED2  (via drill 0.3)
  Top 0.127: R49.1 55.75,27.24 v55.82,27.3 | v4.7,8.19 5.52,7.37 13.08,7.37 13.97,6.48 AM3352-SOM-EVB-PLATFORM.4-23
  Bottom 0.127: v55.82,27.3 55.82,29.15 58.74,32.07 59.18,32.07 59.5,32.38 59.5,32.89 57.02,35.37 9.91,35.37 2.86,28.32 2.86,10.03 v4.7,8.19
P3_21/LED3  (1 unrouted)
SCL
  Top 0.127: R8.1 45.85,8.38 45.85,8.57 46.55,9.27 46.55,13.08 46.99,13.53 48.96,13.53 49.34,13.91 49.66,13.91 U$2.1
SYS_RESETN  (via drill 0.3)
  Top 0.127: AM3352-SOM-EVB-PLATFORM.4-28 11.43,2.86 v12.06,3.49 | v30.04,1.91 33.85,1.91 34.23,2.29 34.23,4.38 34.73,4.89 36.64,4.89 38.1,3.43 41.02,3.43 | 41.02,3.43 43.81,3.43 45.47,5.08 46.1,5.08 46.99,5.97 AM3352-SOM-EVB-PLATFORM.3-21 | AM3352-SOM-EVB-PLATFORM.2-24 46.99,36.45 47.88,35.56 v59.12,35.56 | 41.02,3.43 v41.02,3.56
  Bottom 0.127: v12.06,3.49 12.89,3.49 14.48,1.91 v30.04,1.91 | v59.12,35.56 61.4,35.56 62.1,36.26 62.61,36.26 62.93,35.94 62.93,6.35 59.05,2.48 42.1,2.48 v41.02,3.56
USB0-DRV  (via drill 0.3)
  Top 0.127: R4.2 R2.1 42.48,31.81 42.48,33.59 41.53,34.54 34.48,34.54 33.72,33.78 30.67,33.78 28.07,31.18 v7.3,31.18 | v28.96,7.43 28.96,8.76 27.43,10.29 27.43,11.62 26.61,12.45 26.42,12.45 U1.4 | v34.8,4.13 34.8,1.4 35.43,0.76 v44.13,0.76 47.12,0.76 47.69,1.33 47.69,3.11 47.88,3.3 49.91,3.3 50.8,2.41 AM3352-SOM-EVB-PLATFORM.3-16
  Bottom 0.127: v28.96,7.43 32.26,4.13 v34.8,4.13 | v7.3,31.18 3.37,27.24 3.37,13.02 4.76,11.62 4.76,9.02 13.02,0.76 v44.13,0.76
USB0-ID  (via drill 0.3)
  Top 0.127: AM3352-SOM-EVB-PLATFORM.3-12 53.34,2.98 52.13,4.19 v51.37,4.19 | v42.8,4.25 38.1,4.25 v37.47,4.89 | v5.97,16.95 5.52,17.4 5.52,18.03 5.97,18.48 6.86,18.48 USB_OTG.ID
  Bottom 0.127: v51.37,4.19 46.23,4.19 46.16,4.25 v42.8,4.25 | v37.47,4.89 37.47,4.51 35.94,2.98 17.14,2.98 10.29,9.84 10.29,13.02 9.97,13.34 9.46,13.34 9.08,12.95 9.08,12.57 8.76,12.26 8.26,12.26 5.97,14.54 v5.97,16.95
USB0-VBUS  (via drill 0.3)
  Top 0.127: R1.1 49.15,25.72 49.97,24.89 v49.97,23.11 | v55.24,4.89 54.42,4.89 53.34,5.97 AM3352-SOM-EVB-PLATFORM.3-11
  Bottom 0.127: v49.97,23.11 49.97,22.16 59.44,12.7 60.58,12.7 60.9,12.38 60.9,9.97 55.82,4.89 v55.24,4.89
USB0_CE  (via drill 0.3)
  Top 0.127: R2.2 45.02,29.15 v45.02,29.21 | v52.7,31.11 53.02,30.8 53.09,30.8 53.4,30.48 53.4,29.46 53.85,29.02 54.74,29.02 54.93,28.83 v54.93,27.05 | v55.24,3.56 54.48,3.56 53.91,2.98 53.91,1.21 53.72,1.02 52.96,1.02 52.07,1.91 AM3352-SOM-EVB-PLATFORM.3-14
  Bottom 0.127: v45.02,29.21 47.5,29.21 48.07,29.78 48.58,29.78 49.97,28.38 49.97,27.05 50.29,26.73 50.8,26.73 51.12,27.05 51.12,29.53 v52.7,31.11 | v54.93,27.05 54.93,23.43 59.05,19.3 59.05,15.24 61.53,12.76 61.53,9.84 v55.24,3.56
USB0_DM  (via drill 0.3)
  Top 0.127: AM3352-SOM-EVB-PLATFORM.3-15 50.8,5.97 v49.66,4.83 | v38.73,4.83 v40.45,4.83 | v8.51,20.19 6.99,20.19 6.92,20.13 USB_OTG.D-
  Bottom 0.127: v40.45,4.83 v49.66,4.83 | v38.73,4.83 35.56,8 28.57,8 27.43,6.86 20.45,6.86 20.13,7.18 17.78,7.18 13.21,11.75 13.21,16.51 9.53,20.19 v8.51,20.19
USB0_DP  (1 unrouted)
VCC  (via drill 0.3)
  Top 0.127: R47.2 40.89,20.89 41.72,21.72 v41.72,23.5 | C47.1 40.83,30.1 v40.01,29.27 40.01,29.34 39.69,29.65 37.02,29.65 35.15,31.53 | AM3352-SOM-EVB-PLATFORM.2-3 34.29,32.38 35.15,31.53 | v48.32,11.37 C1.1 | AM3352-SOM-EVB-PLATFORM.3-3 58.42,6.48 v56.9,8 56.9,7.94 56.71,7.94 56.13,7.37 52.96,7.37 52.64,7.05 52.64,5.27 52.13,4.76 50.42,4.76 49.21,3.56 44.32,3.56 43.75,2.98 43.75,1.21 43.56,1.02 36.45,1.02 36.13,1.33 36.13,3.11 35.69,3.56 v35.43,3.56 | AM3352-SOM-EVB-PLATFORM.1-3 5.08,29.15 v5.59,28.64 6.29,28.64 6.6,28.32 8.76,28.32 9.27,27.81 v9.27,19.62 | U6.3 v4.76,27.81 | AM3352-SOM-EVB-PLATFORM.4-3 26.67,5.97 25.59,4.89 v24.77,4.89 | v13.08,8.7 12.38,9.4 U2.3 | v34.92,31.3 35.15,31.53 | v31.11,31.24 30.1,31.24 v29.53,31.81
  Bottom 0.127: v41.72,23.5 41.72,26.23 42.35,26.86 42.35,27.37 41.72,28 40.39,28 40.13,27.75 39.62,27.75 39.31,28.07 39.31,28.57 v40.01,29.27 | v48.32,11.37 48.58,11.37 51.37,8.57 56.33,8.57 v56.9,8 | v4.76,27.81 v5.59,28.64 8.45,31.5 25.46,31.5 25.78,31.81 v29.53,31.81 | v9.27,19.62 9.27,18.22 12.95,14.54 12.95,8.83 v13.08,8.7 16.89,4.89 v24.77,4.89 27.56,4.89 28.89,3.56 v35.43,3.56 | v34.92,31.3 31.18,31.3 v31.11,31.24

## Text on the board
bNames: 2 | 4 | 6 | 8 | 10 | 12 | 14 | 16 | 18 | 20 | 22 | 24 | 26 | 28 | 30 | 32 | 34 | 36 | 38 | 40 | 2 | 4 | 6 | 8 | 10 | 12 | 14 | 16 | 18 | 20 | 1 | 3 | 5 | 7 | 9 | 11 | 13 | 15 | 17 | 19 | 21 | 23 | 25 | 27 | 29 | 31 | 33 | 35 | 37 | 39 | 1 | 3 | 5 | 7 | 9 | 11 | 13 | 15 | 17 | 19 | GND | D+ | D- | +5V | AM3352-SOM-EVB | GND | D+ | D- | +5V | Rev.D | DESCRIPTION | STATE | JUMPER | GND | D+ | D- | +5V | USB power supply is disabled (default) | USB_PWR_E | USB power supply is enabled | 5V power supply is disabled | 5V_E | 5V power supply is enabled (default) | GND | D+ | D- | +5V | USB1_DRV is disabled | HOST_DRV | USB1_DRV is enabled (default) | CAN_T is disabled (default) | CAN_T | CAN_T is enabled | CAN1_TX/CAN0_TX | CAN0 is selected | CAN1_RX/CAN0_RX | CAN1_TX/CAN0_TX | CAN1 is selected (default) | CAN1_RX/CAN0_RX | GND | CAN_L | TX | RX | GND | CAN_H | 6-16VDC | + | - | 2 | 4 | 6 | 8 | 10 | 12 | 14 | 16 | 18 | 20 | 22 | 24 | 26 | 28 | 30 | 32 | 34 | 36 | 38 | 40 | 2 | 4 | 6 | 8 | 10 | 2 | 4 | 6 | 8 | 10 | 1 | 3 | 5 | 7 | 9 | 11 | 13 | 15 | 17 | 19 | 21 | 23 | 25 | 27 | 29 | 31 | 33 | 35 | 37 | 39 | 1 | 3 | 5 | 7 | 9 | 1 | 3 | 5 | 7 | 9